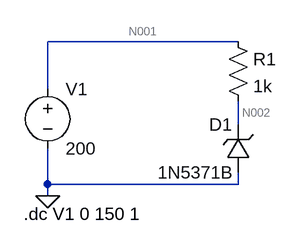
[diagram p0: schematic schemat.asc]
schemat.asc, the LTspice schematic file:
Version 4
SHEET 1 880 680
WIRE 208 48 -48 48
WIRE -48 112 -48 48
WIRE 208 160 208 128
WIRE -48 240 -48 192
WIRE 208 240 208 224
WIRE 208 240 -48 240
WIRE -48 256 -48 240
FLAG -48 256 0
SYMBOL voltage -48 96 R0
WINDOW 123 0 0 Left 0
WINDOW 39 0 0 Left 0
SYMATTR InstName V1
SYMATTR Value 200
SYMBOL res 192 32 R0
SYMATTR InstName R1
SYMATTR Value 1k
SYMBOL zener 224 224 R180
WINDOW 0 24 64 Left 2
WINDOW 3 24 0 Left 2
SYMATTR InstName D1
SYMATTR Value 1N5371B
SYMATTR Description Diode
SYMATTR Type diode
TEXT -80 280 Left 2 !.dc V1 0 150 1

The netlist it stands for:
* schemat.asc
V1 N001 0 200
R1 N001 N002 1k
D1 0 N002 1N5371B
.model D D
.lib standard.dio
.dc V1 0 150 1
.backanno
.end

* Results of the author's LTspice run, read from the files saved beside the schematic
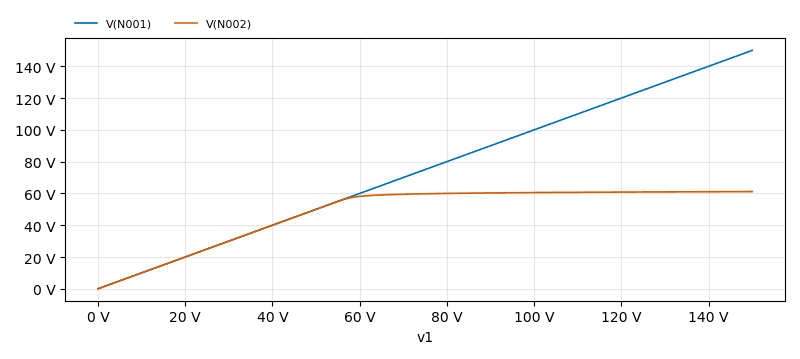
[diagram p1: DC transfer characteristic of schemat.asc, plotted from the saved traces]
* DC transfer characteristic, 1 run:
*   V(N001): 0 V at v1=0 V, 150 V at v1=150 V, min 0 V, max 150 V
*   V(N002): 0 V at v1=0 V, 61.17 V at v1=150 V, min 0 V, max 61.17 V